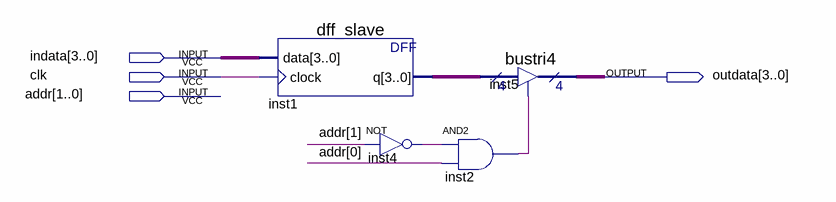
[diagram p0: schematic sheet]
// Quartus schematic slave2.bdf as structural Verilog: 4 symbols, 4 pins
module slave2 (
  input  [3:0] indata,
  input  clk,
  input  [1:0] addr,
  output [3:0] outdata
);

  wire inst2_out, inst4_out;
  wire [3:0] inst1_q;

  dff_slave inst1 (.data(indata), .clock(clk), .q(inst1_q));
  not inst4 (inst4_out, addr[1]);
  bustri4 inst5 (.enabledt(inst2_out), .data(inst1_q), .tridata(outdata));
  and inst2 (inst2_out, inst4_out, addr[0]);
endmodule
